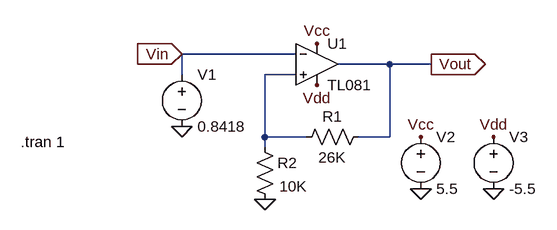
[diagram p0: schematic Forstærker - faktor 3.asc]
Forstærker - faktor 3.asc, the LTspice schematic file:
Version 4
SHEET 1 880 680
WIRE 144 128 -32 128
WIRE 288 144 208 144
WIRE 352 144 288 144
WIRE -32 160 -32 128
WIRE 144 160 96 160
WIRE 96 256 96 160
WIRE 160 256 96 256
WIRE 288 256 288 144
WIRE 288 256 240 256
WIRE 96 272 96 256
FLAG -32 240 0
FLAG 352 144 Vout
IOPIN 352 144 Out
FLAG 336 256 Vcc
FLAG 448 256 Vdd
FLAG 96 352 0
FLAG -32 128 Vin
IOPIN -32 128 In
FLAG 336 336 0
FLAG 448 336 0
FLAG 176 112 Vcc
FLAG 176 176 Vdd
SYMBOL voltage -32 144 R0
WINDOW 123 24 124 Left 2
WINDOW 39 0 0 Left 2
SYMATTR InstName V1
SYMATTR Value 0.8418
SYMBOL voltage 336 240 R0
WINDOW 123 0 0 Left 2
WINDOW 39 0 0 Left 2
SYMATTR InstName V2
SYMATTR Value 5.5
SYMBOL voltage 448 240 R0
WINDOW 123 0 0 Left 2
WINDOW 39 0 0 Left 2
SYMATTR InstName V3
SYMATTR Value -5.5
SYMBOL res 80 256 R0
WINDOW 0 66 40 Right 2
WINDOW 3 81 76 Right 2
SYMATTR InstName R2
SYMATTR Value 10K
SYMBOL res 256 240 R90
WINDOW 0 0 56 VBottom 2
WINDOW 3 32 56 VTop 2
SYMATTR InstName R1
SYMATTR Value 26K
SYMBOL Opamps\\TL081 176 80 R0
WINDOW 3 85 96 Right 2
SYMATTR InstName U1
TEXT -280 264 Left 2 !.tran 1

The netlist it stands for:
* Forstærker - faktor 3.asc
V1 Vin 0 0.8418
V2 Vcc 0 5.5
V3 Vdd 0 -5.5
R2 N001 0 10K
R1 Vout N001 26K
XU1 N001 Vin Vcc Vdd Vout TL081  ; pins In+ In- V+ V- OUT
.tran 1
.backanno
.end